# EAGLE schematic USBシリアル (EAGLE 9.6.2)
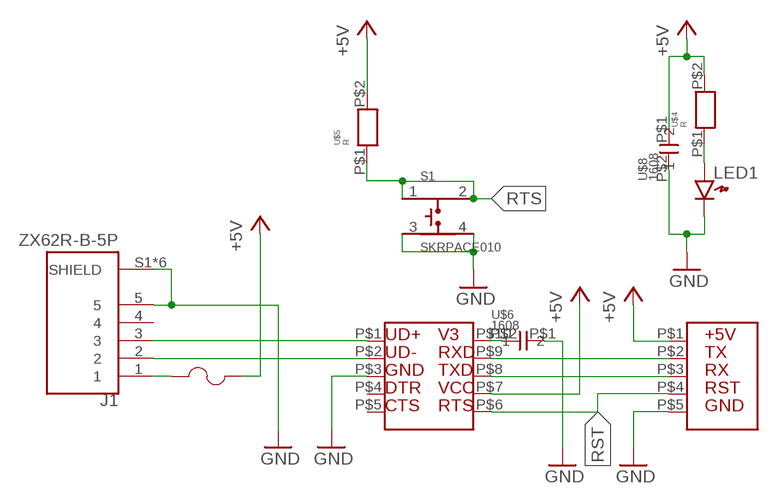
[diagram p0: schematic, sheet 1]

## Parts
J1  ZX62R-B-5P  [HRS_ZX62R-B-5P]
LED1  LED1608  [LED1608]
S1  SKRPACE010  [SW_SKRPACE010]
U$1  CH340K  [CH340K]
U$2  F  [F]
U$3  SI  [SI]
U$4  R  [1608]
U$5  R  [1608]
U$6  1608  [CON]
U$8  1608  [CON]

## Nets
+5V: U$1.P$7 U$2.P$1 U$3.P$1 U$4.P$2 U$5.P$2 U$8.P$1
GND: J1.5 J1.S1(SHIELD) J1.S2(SHIELD) J1.S3(SHIELD) J1.S4(SHIELD) J1.S5(SHIELD) J1.S6(SHIELD) LED1.K S1.3 S1.4 U$1.P$3 U$3.P$5 U$6.P$1 U$8.P$2
N$1: J1.2 U$1.P$2
N$2: J1.3 U$1.P$1
N$3: LED1.A U$4.P$1
N$4: J1.1 U$2.P$2
N$8: U$1.P$8 U$3.P$3
N$9: U$1.P$9 U$3.P$2
N$10: U$1.P$10 U$6.P$2
RST: U$1.P$6 U$3.P$4
RTS: S1.1 S1.2 U$5.P$1
Unconnected: J1.4 U$1.P$4 U$1.P$5

## Library data of the parts
J1 = USBMicro:ZX62R-B-5P: Conn Micro USB 2.0 Type B RCP 5 POS 0.65mm Solder RA SMD 5 Terminal 1 Port Embossed T/R Check prices <https://pricing.snapeda.com/parts/ZX62R-B-5P/Hirose/view-part?ref=eda>; AVAILABILITY: In Stock; DESCRIPTION: USB - micro B USB 2.0 Receptacle Connector 5 Position Surface Mount, Right Angle; MF: Hirose; MP: ZX62R-B-5P; PACKAGE: None; PRICE: None
LED1 = generic:LED: Generic LEDs
S1 = SKRPACE010:SKRPACE010: Switch Tactile N.O. SPST Button J-Bend 0.05A 16VDC 2.55N SMD Automotive T/R Check prices <https://pricing.snapeda.com/parts/SKRPACE010/ALPS/view-part?ref=eda>; AVAILABILITY: In Stock; DESCRIPTION: Switch Tactile N.O. SPST Button J-Bend 0.05A 16VDC 2.55N SMD Automotive T/R; MF: ALPS; MP: SKRPACE010; PACKAGE: None; PRICE: None
U$1 = CH340K:CH340K
U$2 = F:F
U$3 = プログラム入力:SI
U$4 U$5 = R 1608:R
U$6 U$8 = con1608:1608